# Altium schematic sheet PPSDriver.SchDoc: PPS Driver Board
size Letter; Revision: 1; SheetNumber: 1; SheetTotal: 1; Client: Facebook; LeaflabsProject: Sawyer
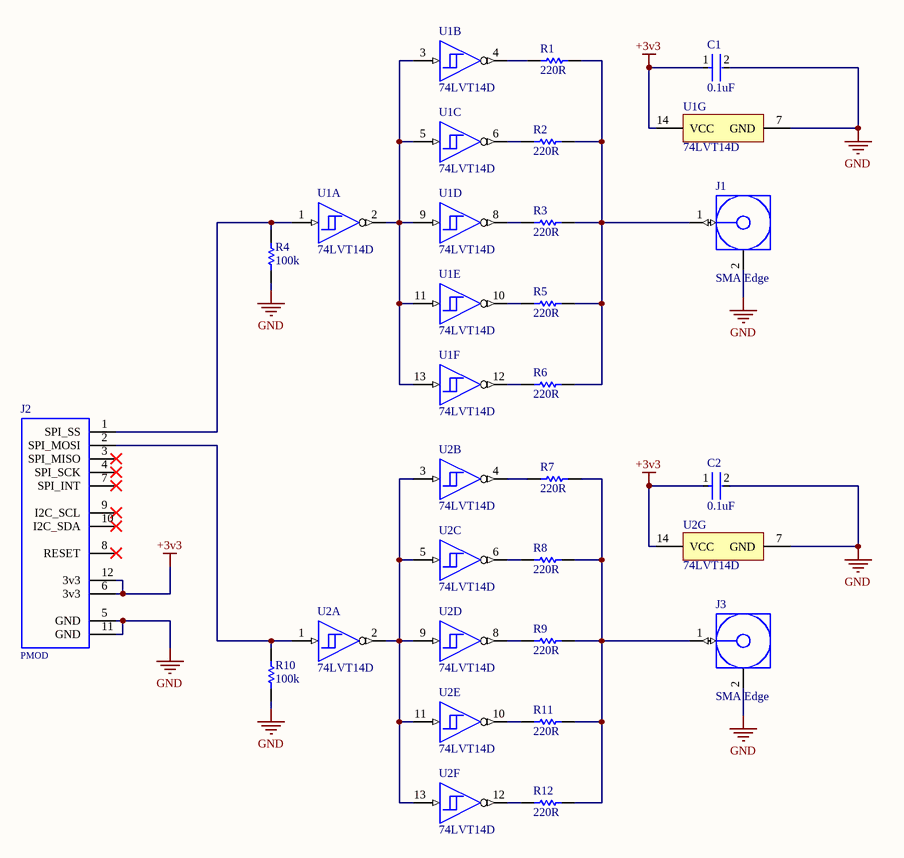
[diagram p0: PPSDriver.SchDoc]

## Parts
C1  0.1uF  [FP-CC0603-DA-IPC_B]
C2  0.1uF  [FP-CC0603-DA-IPC_B]
J1  SMA Edge  [FP-CON-SMA-EDGE-S-MFG]
J2  PMOD  [PMOD]
J3  SMA Edge  [FP-CON-SMA-EDGE-S-MFG]
R1  220R  [RESC1609X50X30NL10T20]
R2  220R  [RESC1609X50X30NL10T20]
R3  220R  [RESC1609X50X30NL10T20]
R4  100k  [RESC1609X50X30NL10T20]
R5  220R  [RESC1609X50X30NL10T20]
R6  220R  [RESC1609X50X30NL10T20]
R7  220R  [RESC1609X50X30NL10T20]
R8  220R  [RESC1609X50X30NL10T20]
R9  220R  [RESC1609X50X30NL10T20]
R10  100k  [RESC1609X50X30NL10T20]
R11  220R  [RESC1609X50X30NL10T20]
R12  220R  [RESC1609X50X30NL10T20]
U1  74LVT14D  [SOIC14A_L]  (parts A,B,C,D,E,F,G of 7)
U2  74LVT14D  [SOIC14A_L]  (parts A,B,C,D,E,F,G of 7)

## Nets
+3v3: C1.1 C2.1 J2.6(3v3) J2.12(3v3) U1.14(VCC) U2.14(VCC)
GND: C1.2 C2.2 J1.2 J2.5(GND) J2.11(GND) J3.2 R4.1 R10.1 U1.7(GND) U2.7(GND)
NetJ1_1: J1.1 R1.2 R2.2 R3.2 R5.2 R6.2
NetJ2_1: J2.1(SPI_SS) R4.2 U1.1(1A)
NetJ2_2: J2.2(SPI_MOSI) R10.2 U2.1(1A)
NetJ3_1: J3.1 R7.2 R8.2 R9.2 R11.2 R12.2
NetR1_1: R1.1 U1.4(~{2Y})
NetR2_1: R2.1 U1.6(~{3Y})
NetR3_1: R3.1 U1.8(~{4Y})
NetR5_1: R5.1 U1.10(~{5Y})
NetR6_1: R6.1 U1.12(~{6Y})
NetR7_1: R7.1 U2.4(~{2Y})
NetR8_1: R8.1 U2.6(~{3Y})
NetR9_1: R9.1 U2.8(~{4Y})
NetR11_1: R11.1 U2.10(~{5Y})
NetR12_1: R12.1 U2.12(~{6Y})
NetU1_2: U1.2(~{1Y}) U1.3(2A) U1.5(3A) U1.9(4A) U1.11(5A) U1.13(6A)
NetU2_2: U2.2(~{1Y}) U2.3(2A) U2.5(3A) U2.9(4A) U2.11(5A) U2.13(6A)

Not connected (* = marked no-connect by the designer): J2 3(SPI_MISO)* 4(SPI_SCK)* 7(SPI_INT)* 8(RESET)* 9(I2C_SCL)* 10(I2C_SDA)*

## Notes on the sheet
- PROJ
- TITLE
- CLIENT
- REV
- DATE
- LeafLabs
- SHEET
- OF
- CONFIDENTIAL. DO NOT DISTRIBUTE.

## Library data of the parts
C1 C2 = CAP-0603-0.1uF: CAP CER 0.1UF 16V X7R 0603; Manufacturer Part Number: CC0603KRX7R7BB104; Manufacturer: YAGEO; Tolerance: 0.1; Value: 100 nF; Temperature Coefficient: 15%; Material: Ceramic; Voltage Rating: 16 V; Package: CC0603-DA; ComponentLink2Description: Datasheet; Octopart: https://octopart.com/cc0603krx7r7bb104-yageo-192941; Temperature Range High: +125°C; Digikey Description: CAP CER 0.1UF 16V X7R 0603; Voltage: 16 V; Device Class L2: Capacitors; Height: 0.9mm; Temperature: -55°C to +125°C; Device Class L1: Passive Components; Device Class L3: Ceramic Capacitors; ComponentLink2URL: http://www.yageo.com/documents/recent/UPY-GPHC_X7R_6.3V-to-50V_18.pdf; Footprint Url: http://www.yageo.com/exep/pages/download/literatures/UPY-C_GEN_24.pdf; RoHS: TRUE; Temperature Range Low: -55°C; Temperature Characteristic: X7R; Lead Free: Yes; Capacitance: 100 nF; Category: Cap; Mouser Description: Multilayer Ceramic Capacitor, CC Series, 0.1 - F, - 10%, X7R, 16 V, 0603 [1608 Metric]; Automotive: No; Supplier 1: Digi-Key; Supplier Part Number 1: 311-1088-1-ND
J1 J3 = SMA_EDGE: 50 Ohm Edge mount SMA; Supplier 1: Digi-Key; Supplier Part Number 1: CON-SMA-EDGE-S-ND
J2 = PMOD-TH: PMOD Connector, Through Hole, Standard pinout; Pitch: 2.54mm; Gender: Male; Pin Number: 12; Row Number: Dual; Withstanding Voltage: 500VAC; Contact Resistance: 20mOhm; Rated Current: 3A; Orientation: Angled; Publisher: WurthElektronik; Supplier 1: Digi-Key; Supplier Part Number 1: 732-5354-ND
R1-R3 R5-R9 R11 R12 = RES-0603-220R: Resistor 0603 220 Ohm; Supplier 1: Digi-Key; Supplier Part Number 1: 311-220GRCT-ND
R4 R10 = RES-0603-100k: Resistor 0603 100k Ohm; Supplier 1: Digi-Key; Supplier Part Number 1: YAG2294CT-ND
U1 U2 = 74LVT14D: Hex Schmitt-Trigger Inverters, D0014A, LARGE T&R; Schmitt Trigger: Yes; Output Type: CMOS; Input Type: CMOS; Generic Part Number: 74LVT14; Supplier 1: Digi-Key; Supplier Part Number 1: 1727-6371-1-ND